# EAGLE design BME280_Daughter_1_2 (EAGLE 9.2.0)
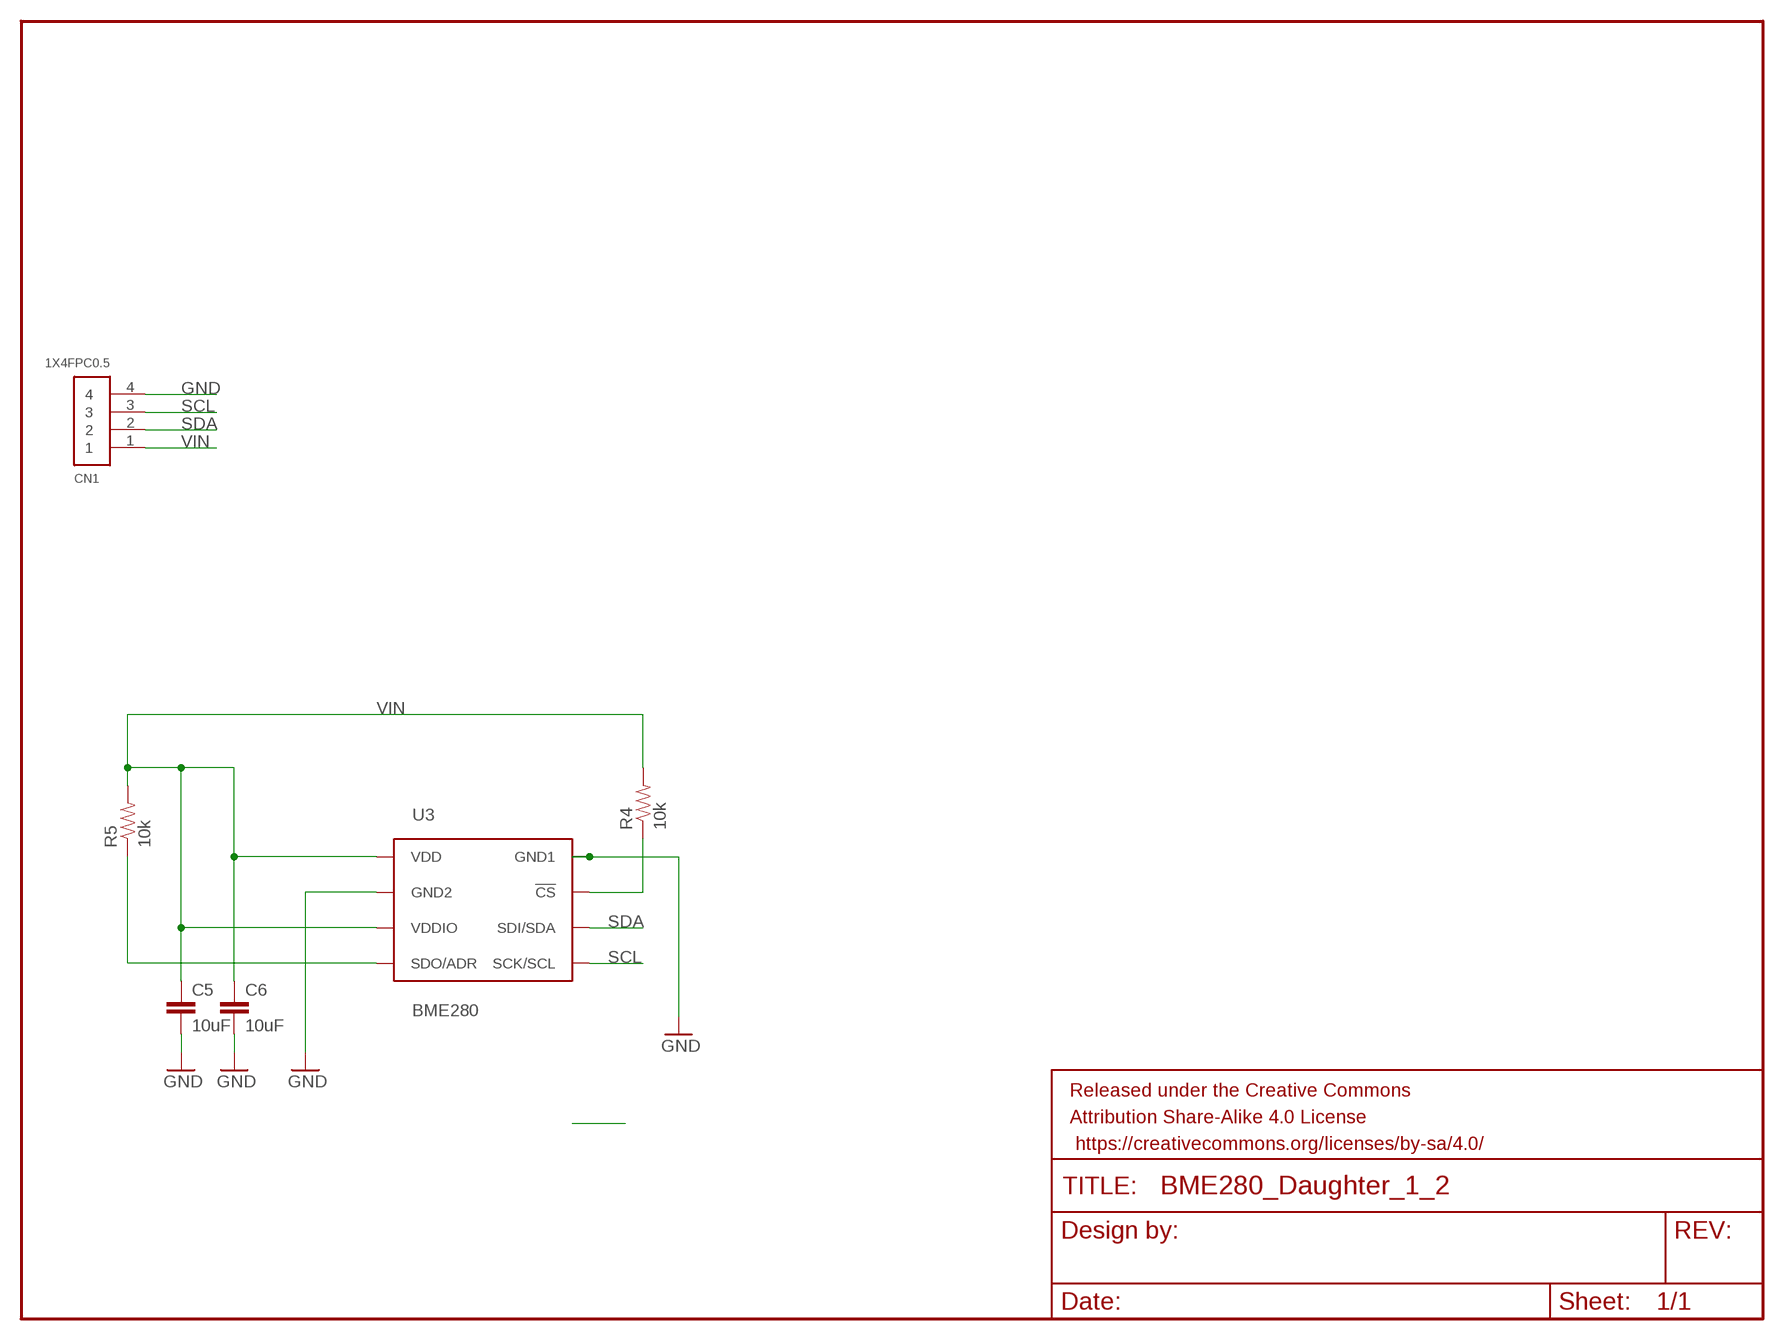
[diagram p0: schematic, sheet 1]

## Parts
C5  10uF  CAP0805  [0805]
C6  10uF  CAP0805  [0805]
CN1  1X4FPC0.5  [FPC_0.5MM-4]
FRAME1  FRAME-LETTER  [CREATIVE_COMMONS]
R4  10k  RESISTOR0805-RES  [0805]
R5  10k  RESISTOR0805-RES  [0805]
U3  BME280  [BME280_LGA]

## Nets
GND: C5.2 C6.2 CN1.4 U3.P$1(GND1) U3.P$7(GND2)
N$5: R4.1 U3.P$2(!CS)
N$17: R5.1 U3.P$5(SDO/ADR)
SCL: CN1.3 U3.P$4(SCK/SCL)
SDA: CN1.2 U3.P$3(SDI/SDA)
VIN: C5.1 C6.1 CN1.1 R4.2 R5.2 U3.P$6(VDDIO) U3.P$8(VDD)

## Library data of the parts
C5 C6 = SparkFun-Capacitors:CAP: Capacitor Standard 0603 ceramic capacitor, and 0.1" leaded capacitor.
CN1 = adafruit:1X4: 4-pin connector
FRAME1 = SparkFun-Aesthetics:FRAME-LETTER: Schematic Frame Standard 8.5x11 US Letter frame
R4 R5 = SparkFun-Passives:RESISTOR: Resistor Basic schematic elements and footprints for 0603, 1206, and PTH resistors.
U3 = BME280ComponentLibrary:BME280; PROD_ID: IC-13090

## Board
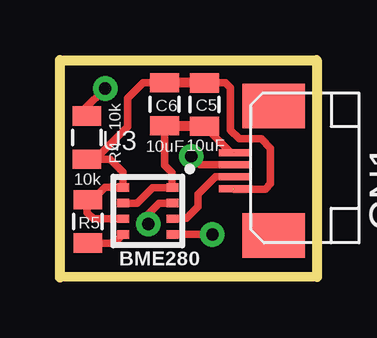
[diagram p1: board, top side]
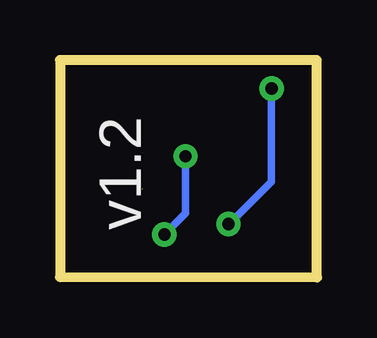
[diagram p2: board, bottom side, seen from below]

Size 10.72 x 9.07 mm. Coordinates in mm from the lower left corner, seen from the top.
Outline: 0,0 0.01,9.07 10.71,9.07 10.72,0.02 0.02,0.04
Copper layers (1*16): Top 0.035mm / dielectric 1.5mm / Bottom 0.035mm
Design rules "SparkFun": minimum track width 8mil, minimum drill 20mil, track to track 8mil, track to pad 8mil, pad to pad 8mil, via to via 8mil, smd to smd 8mil, copper to edge 8mil, drill to drill 8mil, minimum pad ring 12mil, minimum via ring 10mil, stop-mask expansion 4mil, vias tented up to drill 20mil, thermal gap 10mil

### Footprints (pad centres in the part's own frame; a part is rotated, then mirrored left to right if it is on the bottom)
0805 = smd 0.8 x 1.2: 1 -0.9,0; 2 0.9,0
FPC_0.5MM-4 = smd 0.3 x 1.25: 1 -0.75,-0.45; 2 -0.25,-0.45; 3 0.25,-0.45; 4 0.75,-0.45 | smd 1.85 x 2.6: MT -2.7,-2.1; MT2 2.7,-2.1
BME280_LGA = smd 0.5 x 0.35: P$1 1.025,0.975; P$2 1.025,0.325; P$3 1.025,-0.325; P$4 1.025,-0.975; P$5 -1.025,-0.975; P$6 -1.025,-0.325; P$7 -1.025,0.325; P$8 -1.025,0.975

### Placement (x,y rotation side)
C5  6.04,7.21 270 top
C6  4.37,7.23 270 top
CN1  6.82,4.45 90 top
FRAME1  13.95,-12.09 0 top  (outside the outline)
R4  1.13,5.84 270 top
R5  1.17,2.34 90 top
U3  3.67,2.78 0 top

### Tracks (layer width: path | path; a pad name or v marks a point on that pad's centre or on a via)
GND  (1 unrouted)
  Top 0.305: C6.2 4.37,4.68 4.67,4.38 4.67,3.77 U3.P$1 3.87,3.75 3.23,3.1 U3.P$7 | C5.2 7.14,5.21 CN1.4
  Top 0.406: C5.2 4.38,6.32 C6.2
N$5  (via drill 0.51 pad 1.02)
  Top 0.305: R4.1 1.04,7.03 v1.89,7.88 | v3.69,2.24 3.69,2.66 4.13,3.1 U3.P$2
  Bottom 0.305: v1.89,7.88 1.89,4 3.69,2.2 v3.69,2.24
N$17
  Top 0.305: R5.1 2.28,1.44 U3.P$5
SCL  (via drill 0.51)
  Top 0.305: U3.P$4 5.51,1.81 v6.36,1.8 | v5.48,5.06 5.84,4.7 CN1.3
  Bottom 0.305: v6.36,1.8 5.48,2.68 v5.48,5.06
SDA
  Top 0.305: U3.P$3 4.71,2.47 5.28,2.47 5.76,2.95 5.76,3.47 6.49,4.2 CN1.2
VIN  (1 unrouted)
  Top 0.305: C5.1 6.91,8.12 7.12,7.91 7.12,6.14 7.48,5.78 8.4,5.78 8.79,5.39 8.79,3.92 8.56,3.69 CN1.1 | 2.63,3.77 1.88,3.77 1.35,3.25 R5.2 1.14,3.22 1.14,2.71 1.4,2.45 1.5,2.45 1.5,2.46 U3.P$6 | 2.63,3.77 U3.P$8 | C6.1 3.48,8.13 2.82,7.47 2.82,6.29 1.47,4.94 R4.2 2.09,4.94 2.64,4.39 2.64,3.79 2.63,3.77
  Top 0.406: C5.1 4.38,8.11 C6.1

### Text on the board
bPlace: v1.2